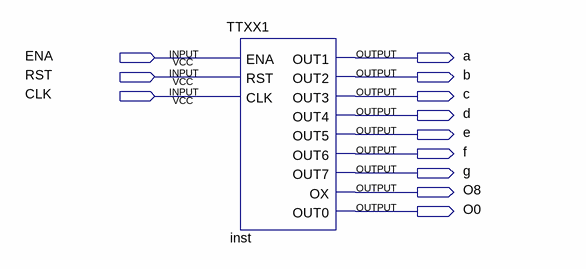
[diagram p0: schematic sheet]
// Quartus schematic exp6.bdf as structural Verilog: 1 symbols, 12 pins
module exp6 (
  input  ENA,
  input  RST,
  input  CLK,
  output a,
  output b,
  output c,
  output d,
  output e,
  output f,
  output g,
  output O8,
  output O0
);

  TTXX1 inst (
    .ENA(ENA), .RST(RST), .CLK(CLK), .OUT1(a), .OUT2(b), .OUT3(c), .OUT4(d), .OUT5(e), .OUT6(f), .OUT7(g),
    .OX(O8), .OUT0(O0));
endmodule
